# Altium schematic sheet 1_P2.schdoc.schdoc
size 309 x 223 mm; Symbol: Sheet-Symbol_A4; Device: Sheet-Symbol_A4; Company: Tianjin University; Version: V2.0; Page Size: A4; @Project Name: 柔性爪二代; @Page Count: 2; @Update Date: 2024-03-28; @Create Date: 2024-03-07; @Schematic Name: Schematic1; @Page No: 2; @Page Name: P2
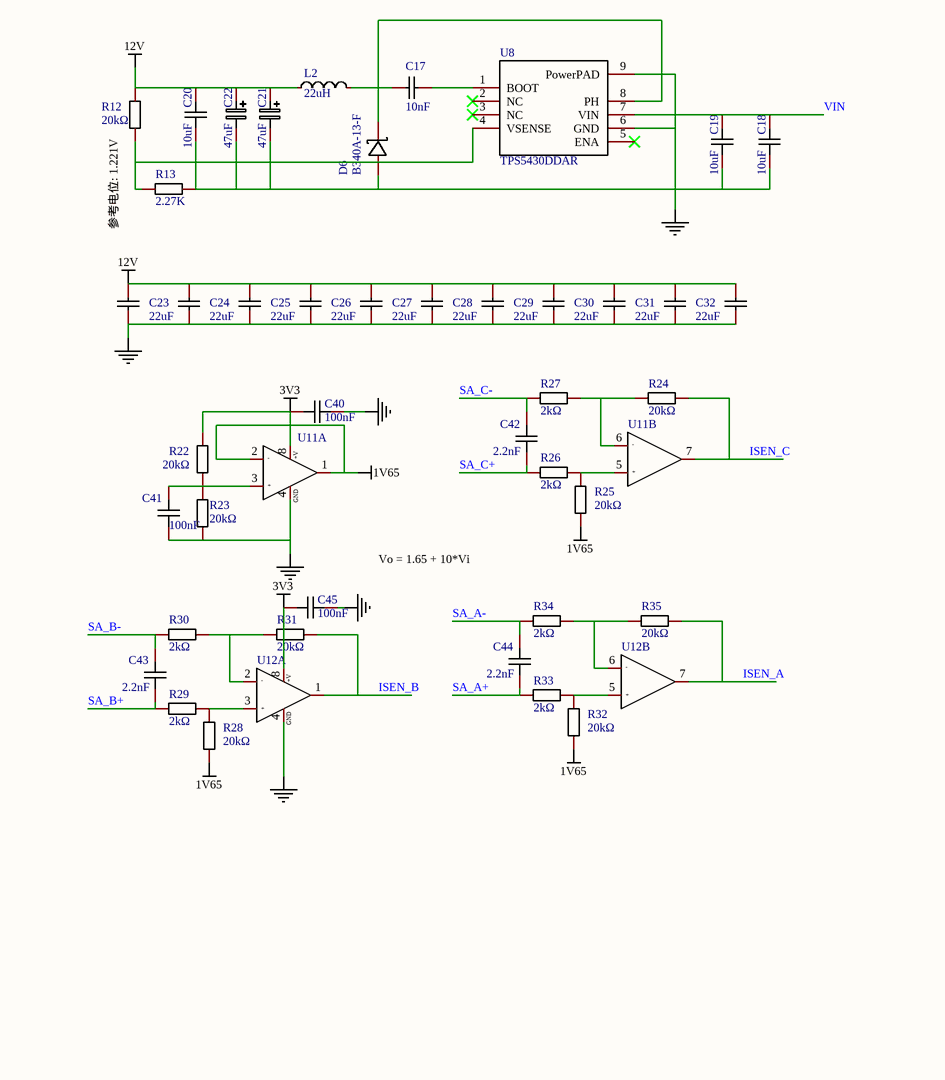
[diagram p0: 1_P2.schdoc.schdoc]

## Parts
C17  10nF  [C0603]
C18  10uF  [C0805]
C19  10uF  [C0805]
C20  10uF  [C0805]
C21  47uF  [CAP-SMD_L3.5-W2.8-R-RD]
C22  47uF  [CAP-SMD_L3.5-W2.8-R-RD]
C23  22uF  [C1206]
C24  22uF  [C1206]
C25  22uF  [C1206]
C26  22uF  [C1206]
C27  22uF  [C1206]
C28  22uF  [C1206]
C29  22uF  [C1206]
C30  22uF  [C1206]
C31  22uF  [C1206]
C32  22uF  [C1206]
C33  22uF  [C1206]  (value not drawn)
C40  100nF  [C0603]
C41  100nF  [C0603]
C42  2.2nF  [C0603]
C43  2.2nF  [C0603]
C44  2.2nF  [C0603]
C45  100nF  [C0603]
D6  B340A-13-F  [SMA_L4.4-W2.6-LS5.0-RD]
L2  22uH  [IND-SMD_L7.0-W6.6_FXL0630]
R12  20kΩ  [R0603]
R13  2.27K  [R0603]
R22  20kΩ  [R0603]
R23  20kΩ  [R0603]
R24  20kΩ  [R0603]
R25  20kΩ  [R0603]
R26  2kΩ  [R0603]
R27  2kΩ  [R0603]
R28  20kΩ  [R0603]
R29  2kΩ  [R0603]
R30  2kΩ  [R0603]
R31  20kΩ  [R0603]
R32  20kΩ  [R0603]
R33  2kΩ  [R0603]
R34  2kΩ  [R0603]
R35  20kΩ  [R0603]
U8  TPS5430DDAR  [ESOP-8_L4.9-W3.9-P1.27-LS6.0-TL-EP]
U11  LM358DR  [SOIC-8_L5.0-W4.0-P1.27-LS6.0-BL]  (value not drawn)  (parts A,B of 2)
U12  LM358DR  [SOIC-8_L5.0-W4.0-P1.27-LS6.0-BL]  (value not drawn)  (parts A,B of 2)

## Nets
1V65: R25.1 R28.1 R32.1 U11.1(OUT1) U11.2(-IN1)
3V3: C40.1 C45.1 R22.2 U11.8(+V) U12.8(+V)
12V: C20.2 C21.1 C22.1 C23.2 C24.2 C25.2 C26.2 C27.2 C28.2 C29.2 C30.2 C31.2 C32.2 C33.2 L2.1 R12.2
GND: C18.1 C19.1 C20.1 C21.2 C22.2 C23.1 C24.1 C25.1 C26.1 C27.1 C28.1 C29.1 C30.1 C31.1 C32.1 C33.1 C40.2 C41.1 C45.2 D6.2(A) R13.1 R23.1 U8.6(GND) U8.9(PowerPAD) U11.4(GND) U12.4(GND)
ISEN_A: R35.2 U12.7(OUT2)
ISEN_B: R31.2 U12.1(OUT1)
ISEN_C: R24.2 U11.7(OUT2)
SA_A+: C44.1 R33.1
SA_A-: C44.2 R34.1
SA_B+: C43.1 R29.1
SA_B-: C43.2 R30.1
SA_C+: C42.1 R26.1
SA_C-: C42.2 R27.1
VIN: C18.2 C19.2 U8.7(VIN)
NetC17_1: C17.1 D6.1(K) L2.2 U8.8(PH)
NetC17_2: C17.2 U8.1(BOOT)
NetC41_2: C41.2 R22.1 R23.2 U11.3(+IN1)
NetR12_1: R12.1 R13.2 U8.4(VSENSE)
NetR24_1: R24.1 R27.2 U11.6(-IN2)
NetR25_2: R25.2 R26.2 U11.5(+IN2)
NetR28_2: R28.2 R29.2 U12.3(+IN1)
NetR30_2: R30.2 R31.1 U12.2(-IN1)
NetR32_2: R32.2 R33.2 U12.5(+IN2)
NetR34_2: R34.2 R35.1 U12.6(-IN2)

Not connected (* = marked no-connect by the designer): U8 2(NC)* 3(NC)* 5(ENA)*

## Notes on the sheet
- 参考电位: 1.221V
- Vo = 1.65 + 10*Vi
- 1
- 2
- 3
- 4
- 5
- 6
- A
- B
- C
- 原理图
- 创建日期
- 更新日期
- 2024-03-28
- 2024-03-07
- 审阅
- 绘制
- 图页
- P2
- 物料编码
- D
- 版本
- 尺寸
- 页
- 共
- V2.0
- A4
- Tianjin University
- (in symbol LM358DR, part A) +
- (in symbol LM358DR, part B) +

## Library data of the parts
C17 = CC0603KRX7R9BB103: Manufacturer: YAGEO(国巨); Add into BOM: yes; Tolerance: ±10%; Voltage Rated: 50V; Temperature Coefficient: X7R; Description: 容值:10nF;精度:±10%;额定电压:50V;材质(温度系数):X7R;; Name: 10nF; Symbol: CC0603KRX7R9BB103; Device: CC0603KRX7R9BB103; Supplier: LCSC; Manufacturer Part: CC0603KRX7R9BB103; Value: 10nF; Supplier Part: C100042; JLCPCB Part Class: Extended Part; LCSC Part Name: 10nF ±10% 50V; Supplier Footprint: 0603; Datasheet: https://atta.szlcsc.com/upload/public/pdf/source/20181008/C309510_22F155564471FAF6A489F7D68F34234E.pdf; Convert to PCB: yes
C18 = GRM21BR61H106KE43L: Manufacturer: muRata(村田); Symbol: FS55X226K500EHG; Add into BOM: yes; Tolerance: ±10%; Voltage Rated: 50V; Temperature Coefficient: X5R; Description: 容值:10uF;精度:±10%;额定电压:50V;材质(温度系数):X5R;; Name: 10uF; Device: GRM21BR61H106KE43L; Supplier: LCSC; Supplier Part: C440198; Manufacturer Part: GRM21BR61H106KE43L; Value: 10uF; JLCPCB Part Class: Basic Part; LCSC Part Name: 10uF ±10% 50V; Supplier Footprint: 0805; Datasheet: https://atta.szlcsc.com/upload/public/pdf/source/20230811/95AAE0C9AF55EDC31B7A4D8B733F534E.pdf; Convert to PCB: yes
C19 C20 = GRM21BR61H106KE43L: Manufacturer: muRata(村田); Add into BOM: yes; Tolerance: ±10%; Voltage Rated: 50V; Temperature Coefficient: X5R; Description: 容值:10uF;精度:±10%;额定电压:50V;材质(温度系数):X5R;; Name: 10uF; Symbol: GRM21BR61H106KE43L; Device: GRM21BR61H106KE43L; Supplier: LCSC; Supplier Part: C440198; Manufacturer Part: GRM21BR61H106KE43L; Value: 10uF; JLCPCB Part Class: Basic Part; LCSC Part Name: 10uF ±10% 50V; Supplier Footprint: 0805; Datasheet: https://atta.szlcsc.com/upload/public/pdf/source/20230811/95AAE0C9AF55EDC31B7A4D8B733F534E.pdf; Convert to PCB: yes
C21 C22 = CA45-B-16V-47uF-K: Manufacturer: CEC(振华新云); Add into BOM: yes; Tolerance: ±10%; Rated Voltage: 16V; Equivalent Series Resistance(ESR): 3Ω@100kHz; Description: 容值:47uF;精度:±10%;额定电压:16V;等效串联电阻:3Ω@100kHz;; Name: 47uF; Symbol: CA45-B-16V-47UF-K; Device: CA45-B-16V-47uF-K; LCSC Part Name: 47uF ±10% 16V; Supplier Part: C136751; Manufacturer Part: CA45-B-16V-47uF-K; Supplier Footprint: CASE-B-3528; JLCPCB Part Class: Extended Part; Datasheet: https://atta.szlcsc.com/upload/public/pdf/source/20200817/C136751_89CB14FC7BB434027D9410E248BC6FA3.pdf; Supplier: LCSC; Convert to PCB: yes; Value: 47uF; Operating Temperature: -55℃~+125℃
C23-C33 = CL31A226KAHNNNE: Manufacturer: SAMSUNG(三星); Add into BOM: yes; Tolerance: ±10%; Voltage Rated: 25V; Temperature Coefficient: X5R; Description: 容值:22uF;精度:±10%;额定电压:25V;材质(温度系数):X5R;; Name: 22uF; Symbol: CL31A226KAHNNNE; Device: CL31A226KAHNNNE; Supplier: LCSC; Manufacturer Part: CL31A226KAHNNNE; Value: 22uF; Supplier Part: C12891; JLCPCB Part Class: Basic Part; LCSC Part Name: 22uF ±10% 25V; Supplier Footprint: 1206; Datasheet: https://atta.szlcsc.com/upload/public/pdf/source/20160218/1457707763339.pdf; Convert to PCB: yes
C40 C41 C45 = 0603B104K500NT: Manufacturer: FH(风华); Symbol: CapAcitance; Add into BOM: yes; Tolerance: ±10%; Voltage Rated: 50V; Temperature Coefficient: X7R; Description: 容值:100nF;精度:±10%;额定电压:50V;材质(温度系数):X7R;; Name: 100nF; Device: 0603B104K500NT; LCSC Part Name: 100nF ±10% 50V; Supplier Part: C30926; Manufacturer Part: 0603B104K500NT; Supplier Footprint: 0603; JLCPCB Part Class: Extended Part; Datasheet: https://atta.szlcsc.com/upload/public/pdf/source/20200305/C486355_26A10D38EF8C2A5C37091D0039909270.pdf; Supplier: LCSC; Convert to PCB: yes; Value: 100nF
C42-C44 = 0603B222K500NT: Manufacturer: FH(风华); Symbol: CapAcitance; Add into BOM: yes; Tolerance: ±10%; Voltage Rated: 50V; Temperature Coefficient: X7R; Description: 容值:2.2nF;精度:±10%;额定电压:50V;材质(温度系数):X7R;; Name: 2.2nF; Device: 0603B222K500NT; LCSC Part Name: 2.2nF ±10% 50V; Supplier Part: C1604; Manufacturer Part: 0603B222K500NT; Supplier Footprint: 0603; JLCPCB Part Class: Basic Part; Datasheet: https://atta.szlcsc.com/upload/public/pdf/source/20200305/C486355_26A10D38EF8C2A5C37091D0039909270.pdf; Supplier: LCSC; Convert to PCB: yes; Value: 2.2nF
D6 = B340A-13-F: Manufacturer: DIODES(美台); Add into BOM: yes; Forward Voltage (Vf@If): 500mV@3A; Reverse Voltage (Vr): 40V; Average Rectified Current (Io): 3A; Reverse Leakage Current (Ir): 500uA@40V; Description: 正向压降(Vf):500mV@3A;直流反向耐压(Vr):40V;平均整流电流(Io):3A;; Name: B340A-13-F; Symbol: B340A-13-F; Device: B340A-13-F; LCSC Part Name: 电压:40V 电流:3A; Supplier Part: C85098; Manufacturer Part: B340A-13-F; Supplier Footprint: SMA(DO-214AC); JLCPCB Part Class: Extended Part; Datasheet: https://atta.szlcsc.com/upload/public/pdf/source/20171023/C134454_15087453575121052549.pdf; Supplier: LCSC; Convert to PCB: yes
L2 = FXL0630-220-M: Manufacturer: cjiang(长江微电); Add into BOM: yes; Tolerance: ±20%; Rated Current: 2.5A; Saturation Current (Isat): 3A; DC Resistance (DCR): 200mΩ; Type: 一体成型电感; Description: 电感值:22uH;精度:±20%;额定电流:2.5A;饱和电流(Isat):3A;类型:一体成型电感;; Name: 22uH; Symbol: FXL0630-220-M; Device: FXL0630-220-M; LCSC Part Name: 22uH ±20% 3A; Supplier Part: C177244; Manufacturer Part: FXL0630-220-M; Supplier Footprint: SMD,6.6x7mm; JLCPCB Part Class: Extended Part; Datasheet: https://atta.szlcsc.com/upload/public/pdf/source/20230516/3A080F5AF8C87BB81C3BA86E5F60E51A.pdf; Supplier: LCSC; Convert to PCB: yes; Value: 22uH
R12 = 0603WAF2002T5E: Manufacturer: UNI-ROYAL(厚声); Symbol: 电阻; Add into BOM: yes; Tolerance: ±1%; Power(Watts): 100mW; Overload Voltage (Max): 75V; Temperature Coefficient: ±100ppm/℃; Description: 电阻类型:厚膜电阻;阻值:20kΩ;精度:±1%;功率:100mW;最大工作电压:75V;温度系数:±100ppm/℃;; Name: 20kΩ; Device: 0603WAF2002T5E; LCSC Part Name: 20kΩ ±1% 100mW 厚膜电阻; Supplier Part: C4184; Manufacturer Part: 0603WAF2002T5E; Supplier Footprint: 0603; JLCPCB Part Class: Basic Part; Datasheet: https://atta.szlcsc.com/upload/public/pdf/source/20200306/C422600_1E6D84923E4A46A82E41ADD87F860B5C.pdf; Supplier: LCSC; Convert to PCB: yes; Type: 厚膜电阻; Value: 20kΩ; Operating Temperature Range: -55℃~+155℃
R13 = Res_0603: Symbol: 电阻; Convert to PCB: yes; Standardization Check: false; Name: 2.27K; Device: Res_0603; Add into BOM: yes; Supplier Footprint: 0603; Value: 2.27K
R22-R25 R28 R31 R32 R35 = 0603WAF2002T5E: Manufacturer: UNI-ROYAL(厚声); Add into BOM: yes; Tolerance: ±1%; Power(Watts): 100mW; Overload Voltage (Max): 75V; Temperature Coefficient: ±100ppm/℃; Description: 电阻类型:厚膜电阻;阻值:20kΩ;精度:±1%;功率:100mW;最大工作电压:75V;温度系数:±100ppm/℃;; Name: 20kΩ; Symbol: 0603WAF2002T5E; Device: 0603WAF2002T5E; Supplier: LCSC; Manufacturer Part: 0603WAF2002T5E; Supplier Part: C4184; Value: 20kΩ; JLCPCB Part Class: Basic Part; LCSC Part Name: 20kΩ ±1% 100mW 厚膜电阻; Supplier Footprint: 0603; Datasheet: https://atta.szlcsc.com/upload/public/pdf/source/20200306/C422600_1E6D84923E4A46A82E41ADD87F860B5C.pdf; Convert to PCB: yes; Type: 厚膜电阻; Operating Temperature Range: -55℃~+155℃
R26 R27 R29 R30 R33 R34 = 0603WAF2001T5E: Manufacturer: UNI-ROYAL(厚声); Add into BOM: yes; Tolerance: ±1%; Power(Watts): 100mW; Overload Voltage (Max): 75V; Temperature Coefficient: ±100ppm/℃; Description: 电阻类型:厚膜电阻;阻值:2kΩ;精度:±1%;功率:100mW;最大工作电压:75V;温度系数:±100ppm/℃;; Name: 2kΩ; Symbol: 0603WAF2001T5E; Device: 0603WAF2001T5E; Supplier: LCSC; Manufacturer Part: 0603WAF2001T5E; Supplier Part: C22975; Value: 2kΩ; JLCPCB Part Class: Basic Part; LCSC Part Name: 2kΩ ±1% 100mW 厚膜电阻; Supplier Footprint: 0603; Datasheet: https://atta.szlcsc.com/upload/public/pdf/source/20200306/C422600_1E6D84923E4A46A82E41ADD87F860B5C.pdf; Convert to PCB: yes; Type: 厚膜电阻; Operating Temperature Range: -55℃~+155℃
U8 = TPS5430DDAR: Manufacturer: TI(德州仪器); Add into BOM: yes; Function: 降压型; Output Type: 可调; Input Voltage: 5.5V~36V; Output Voltage: 1.221V~32.04V; Output Current (Max): 3A; Switching Frequency: 500kHz; Synchronous Rectification: 否; Number of Outputs: 1; Topology: 降压式; Switch tube (built-in/external): 内置; Description: 功能类型:降压型;输出类型:可调;输入电压:5.5V~36V;输出电压:1.221V~32.04V;输出电流(最大值):3A;; Name: TPS5430DDAR; Symbol: TPS5430DDAR; Device: TPS5430DDAR; LCSC Part Name: 降压 3A 36V; Supplier Part: C9864; Manufacturer Part: TPS5430DDAR; Supplier Footprint: SOIC-8-EP; JLCPCB Part Class: 基础库; Datasheet: https://www.ti.com/cn/lit/gpn/tps5430; Supplier: LCSC; Convert to PCB: yes; Operating Temperature: -40℃~+125℃@(TJ)
U11 U12 = LM358DR: Manufacturer: TI(德州仪器); Add into BOM: yes; Number of Circuits: 双路; Gain Bandwidth Product(GBP): 700kHz; Current - Input Bias(Ib): 20nA; Slew Rate(SR): 0.3V/us; Output Current: 40mA; Supply Current: 1mA; Description: 放大器数:双路;增益带宽积(GBP):700kHz;输入偏置电流(Ib):20nA;压摆率(SR):0.3V/us;带宽(-3db):-;; Symbol: LM358DR; Device: LM358DR; LCSC Part Name: 行业标准双路运算放大器; Supplier Part: C5423; Manufacturer Part: LM358DR; Supplier Footprint: SOIC-8; JLCPCB Part Class: 扩展库; Datasheet: https://www.ti.com/cn/lit/gpn/lm358; Supplier: LCSC; Convert to PCB: yes; -3db Bandwidth: -; Operating Temperature: 0℃~+70℃